# Altium schematic sheet Enable SSR.SchDoc
size A
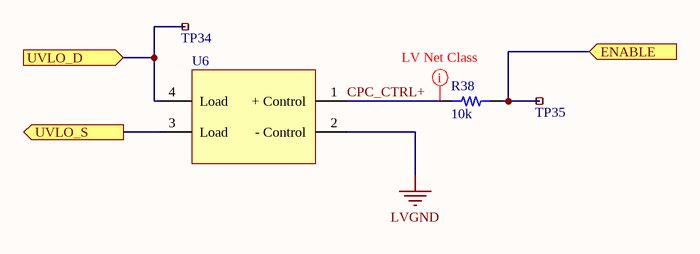
[diagram p0: Enable SSR.SchDoc]

## Parts
R38  value 10k  [RES 0603/1608]  (hidden comment: Resistor 10k 0603 1/10W 1%)
TP34  RCU-0C  [5029]  (value not drawn)
TP35  RCU-0C  [5029]  (value not drawn)
U6  (no value)  [CPC1393GR]

## Ports
ENABLE (in), UVLO_D (in), UVLO_S (out)

## Nets
LVGND: U6.2(-_Control)
CPC_CTRL+: R38.1 U6.1(+_Control)
ENABLE: R38.2 TP35.1 ; port ENABLE
UVLO_D: TP34.1 U6.4(Load) ; port UVLO_D
UVLO_S: U6.3(Load) ; port UVLO_S

## Layout directives
net class LV: CPC_CTRL+

## Library data of the parts
R38 = 313: Manufacturer_id: 1; idResistor: 313; Name: Res_10k_0603_1/10W_1%; Created_By: Nick Mah; Supplier 1: Digi-Key; Drawer_id: 1; Tolerance: 1%; Power: 1/10W; Package: 0603; ComponentLink1Description: Datasheet; Created_Date: 2018-10-20
TP34 TP35 = 28: Test point; Manufacturer_id: 1; idConn: 28; Value: CONN; Created_By: Jason Zhou; Drawer_id: 1; Name: 5029; Num_Contacts: 1; Num_Rows: 1; Package: 5029; MfrPartNo: 5029; Link: https://www.digikey.com/product-detail/en/keystone-electronics/5029/36-5029CT-ND/5980631; ComponentLink1Description: Datasheet; ComponentLink1URL: file:///C:/Users/Jason%20Zhou/Downloads/5029.PDF; Supplier1: Digi-Key; Supplier1PartNo: 36-5029CT-ND; Created_Date: 4/26/2019
U6 = 26: Solid State Relay SPST-NO (1 Form A) 4-SMD (0.300", 7.62mm); Manufacturer_id: 1; MfrPartNo: CPC1393GRTR; idIC_Misc: 26; Value: Null; Created_By: Lynette; Drawer_id: 1; Name: CPC1393; Type: Null; Protocol: Null; Num_Circuits: 1; Data_Rate: Null; Vin(Min): Null; Vin(Max): Null; Package: CPC1393GR; Link: https://www.digikey.com/product-detail/en/ixys-integrated-circuits-division/CPC1393GRTR/CLA270CT-ND/1277144; ComponentLink1Description: Null; ComponentLink1URL: Null; Supplier1: Null; Supplier1PartNo: Null; Updated_By: Null